# EAGLE design CoderDojo-ESP-board (EAGLE 9.6.2)

## Sheet 1 of 2
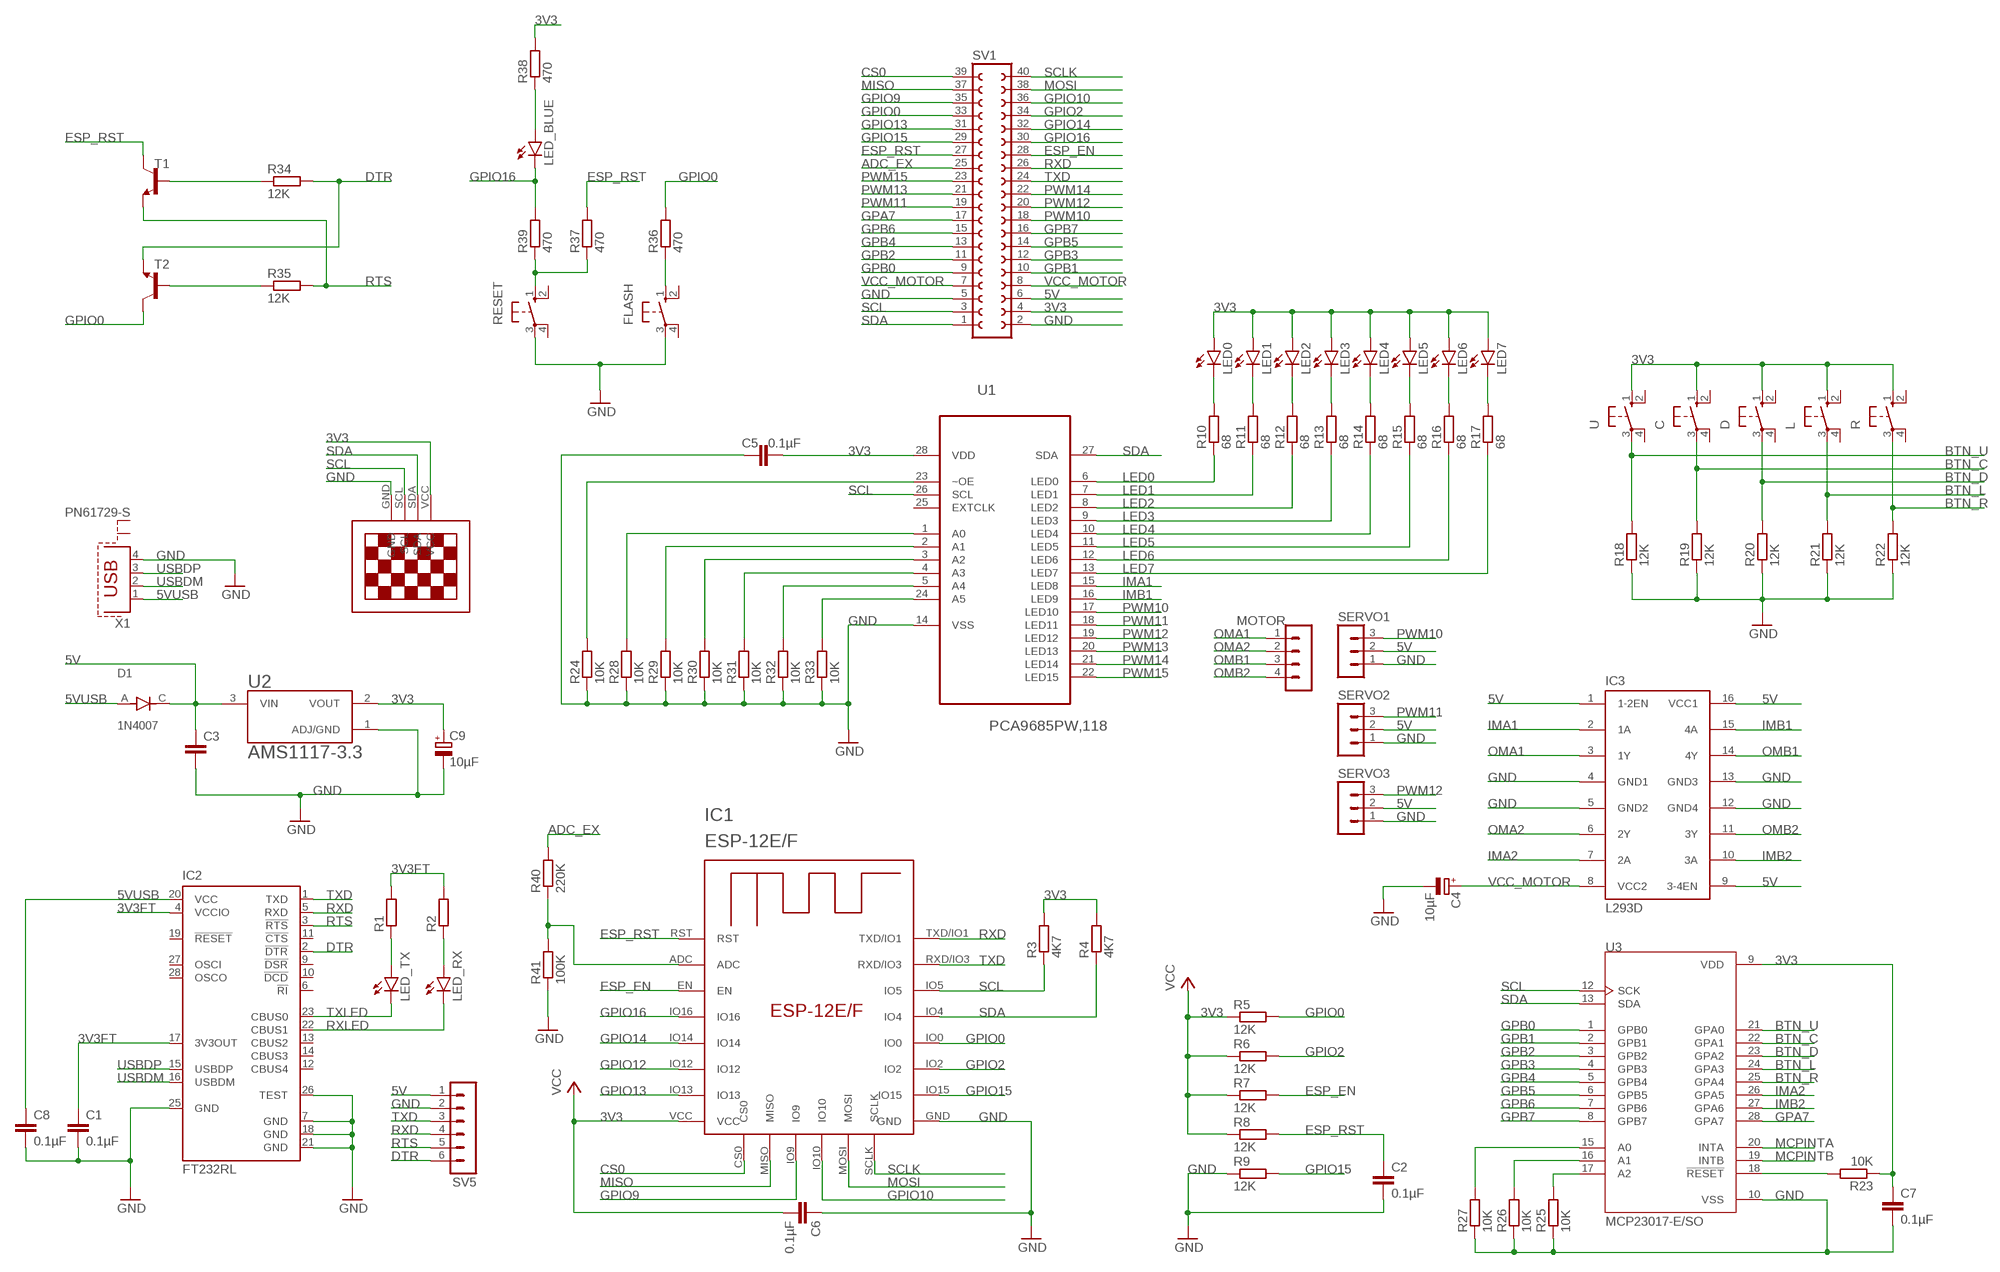
[diagram p0: schematic, sheet 1]

### Parts
C  10-XX  [B3F-10XX]
C1  0.1µF  C-EUC0805  [C0805]
C2  0.1µF  C-EUC0805  [C0805]
C3  C-EUC0805  [C0805]
C4  10µF  CPOL-EUE2-5  [E2-5]
C5  0.1µF  C-EUC0805  [C0805]
C6  0.1µF  C-EUC0805  [C0805]
C7  0.1µF  C-EUC0805  [C0805]
C8  0.1µF  C-EUC0805  [C0805]
C9  10µF  CPOL-EUE2-5  [E2-5]
D  10-XX  [B3F-10XX]
D1  1N4007  [DIOAD1060W80L520D270]
FLASH  10-XX  [B3F-10XX]
IC1  ESP-12E/F  [ESP-12E]
IC2  FT232RL  [SSOP28]
IC3  L293D  [DIL16]
L  10-XX  [B3F-10XX]
LED0  LED3MM  [LED3MM]
LED1  LED3MM  [LED3MM]
LED2  LED3MM  [LED3MM]
LED3  LED3MM  [LED3MM]
LED4  LED3MM  [LED3MM]
LED5  LED3MM  [LED3MM]
LED6  LED3MM  [LED3MM]
LED7  LED3MM  [LED3MM]
LED_BLUE  LEDSML0805  [SML0805]
LED_RX  LEDSML0805  [SML0805]
LED_TX  LEDSML0805  [SML0805]
MOTOR  MA04-1  [MA04-1]
R  10-XX  [B3F-10XX]
R1  R-EU_R0805  [R0805]
R2  R-EU_R0805  [R0805]
R3  4K7  R-EU_R0805  [R0805]
R4  4K7  R-EU_R0805  [R0805]
R5  12K  R-EU_R0805  [R0805]
R6  12K  R-EU_R0805  [R0805]
R7  12K  R-EU_R0805  [R0805]
R8  12K  R-EU_R0805  [R0805]
R9  12K  R-EU_R0805  [R0805]
R10  68  R-EU_R0805  [R0805]
R11  68  R-EU_R0805  [R0805]
R12  68  R-EU_R0805  [R0805]
R13  68  R-EU_R0805  [R0805]
R14  68  R-EU_R0805  [R0805]
R15  68  R-EU_R0805  [R0805]
R16  68  R-EU_R0805  [R0805]
R17  68  R-EU_R0805  [R0805]
R18  12K  R-EU_R0805  [R0805]
R19  12K  R-EU_R0805  [R0805]
R20  12K  R-EU_R0805  [R0805]
R21  12K  R-EU_R0805  [R0805]
R22  12K  R-EU_R0805  [R0805]
R23  10K  R-EU_R0805  [R0805]
R24  10K  R-EU_R0805  [R0805]
R25  10K  R-EU_R0805  [R0805]
R26  10K  R-EU_R0805  [R0805]
R27  10K  R-EU_R0805  [R0805]
R28  10K  R-EU_R0805  [R0805]
R29  10K  R-EU_R0805  [R0805]
R30  10K  R-EU_R0805  [R0805]
R31  10K  R-EU_R0805  [R0805]
R32  10K  R-EU_R0805  [R0805]
R33  10K  R-EU_R0805  [R0805]
R34  12K  R-EU_R0805  [R0805]
R35  12K  R-EU_R0805  [R0805]
R36  470  R-EU_R0805  [R0805]
R37  470  R-EU_R0805  [R0805]
R38  470  R-EU_R0805  [R0805]
R39  470  R-EU_R0805  [R0805]
R40  220K  R-EU_R0805  [R0805]
R41  100K  R-EU_R0805  [R0805]
RESET  10-XX  [B3F-10XX]
SERVO1  MA03-1  [MA03-1]
SERVO2  MA03-1  [MA03-1]
SERVO3  MA03-1  [MA03-1]
SV1  FE20-2  [FE20-2]
SV5  MA06-1  [MA06-1]
T1  BC817-40-NPN-SOT23-BEC  [SOT23-BEC]
T2  BC817-40-NPN-SOT23-BEC  [SOT23-BEC]
U  10-XX  [B3F-10XX]
U1  PCA9685PW,118  [SOP65P640X110-28N]
U2  AMS1117-3.3  [SOT229P700X180-4N]
U3  MCP23017-E/SO  [SOIC127P1030X265-28N]
U$1  13"OLED13"OLED  [1.3"OLED]
X1  PN61729-S  [PN61729-S]

### Nets
3V3: C5.2 C6.2 C7.1 C9.+ C.1(S) D.1(S) IC1.VCC L.1(S) LED0.A LED1.A LED2.A LED3.A LED4.A LED5.A LED6.A LED7.A R3.2 R4.2 R5.1 R6.1 R7.1 R8.1 R23.1 R38.2 R.1(S) SV1.4 U1.28(VDD) U2.2(VOUT) U3.9(VDD) U$1.VCC U.1(S) ; supply symbol labelled VCC
3V3FT: C1.1 IC2.4(VCCIO) IC2.17(3V3OUT) R1.2 R2.2
5V: C3.1 D1.C IC3.1(1-2EN) IC3.9(3-4EN) IC3.16(VCC1) SERVO1.2 SERVO2.2 SERVO3.2 SV1.6 SV5.1 U2.3(VIN)
5VUSB: C8.1 D1.A IC2.20(VCC) X1.1
ADC_EX: R40.2 SV1.25
BTN_C: C.3(P) R19.2 U3.22(GPA1)
BTN_D: D.3(P) R20.2 U3.23(GPA2)
BTN_L: L.3(P) R21.2 U3.24(GPA3)
BTN_R: R22.2 R.3(P) U3.25(GPA4)
BTN_U: R18.2 U3.21(GPA0) U.3(P)
CS0: IC1.CS0 SV1.39
DTR: IC2.2(!DTR) R34.2 SV5.6 T2.E
ESP_EN: IC1.EN R7.2 SV1.28
ESP_RST: C2.1 IC1.RST R8.2 R37.2 SV1.27 T1.C
GND: C1.2 C2.2 C3.2 C4.- C5.1 C6.1 C7.2 C8.2 C9.- FLASH.3(P) IC1.GND IC2.7(GND) IC2.18(GND) IC2.21(GND) IC2.25(GND) IC2.26(TEST) IC3.4(GND1) IC3.5(GND2) IC3.12(GND4) IC3.13(GND3) R9.1 R18.1 R19.1 R20.1 R21.1 R22.1 R24.1 R25.1 R26.1 R27.1 R28.1 R29.1 R30.1 R31.1 R32.1 R33.1 R41.1 RESET.3(P) SERVO1.1 SERVO2.1 SERVO3.1 SV1.2 SV1.5 SV5.2 U1.14(VSS) U2.1(ADJ/GND) U3.10(VSS) U$1.GND X1.4
GPA7: SV1.17 U3.28(GPA7)
GPB0: SV1.9 U3.1(GPB0)
GPB1: SV1.10 U3.2(GPB1)
GPB2: SV1.11 U3.3(GPB2)
GPB3: SV1.12 U3.4(GPB3)
GPB4: SV1.13 U3.5(GPB4)
GPB5: SV1.14 U3.6(GPB5)
GPB6: SV1.15 U3.7(GPB6)
GPB7: SV1.16 U3.8(GPB7)
GPIO0: IC1.IO0 R5.2 R36.2 SV1.33 T2.C
GPIO2: IC1.IO2 R6.2 SV1.34
GPIO9: IC1.IO9 SV1.35
GPIO10: IC1.IO10 SV1.36
GPIO12: IC1.IO12
GPIO13: IC1.IO13 SV1.31
GPIO14: IC1.IO14 SV1.32
GPIO15: IC1.IO15 R9.2 SV1.29
GPIO16: IC1.IO16 LED_BLUE.C R39.2 SV1.30
IMA1: IC3.2(1A) U1.15(LED8)
IMA2: IC3.7(2A) U3.26(GPA5)
IMB1: IC3.15(4A) U1.16(LED9)
IMB2: IC3.10(3A) U3.27(GPA6)
LED0: R10.1 U1.6(LED0)
LED1: R11.1 U1.7(LED1)
LED2: R12.1 U1.8(LED2)
LED3: R13.1 U1.9(LED3)
LED4: R14.1 U1.10(LED4)
LED5: R15.1 U1.11(LED5)
LED6: R16.1 U1.12(LED6)
LED7: R17.1 U1.13(LED7)
MCPINTA: U3.20(INTA)
MCPINTB: U3.19(INTB)
MISO: IC1.MISO SV1.37
MOSI: IC1.MOSI SV1.38
N$1: LED_TX.A R1.1
N$2: LED_RX.A R2.1
N$8: R24.2 U1.23(~OE)
N$10: R23.2 U3.18(!RESET)
N$15: R28.2 U1.1(A0)
N$16: R25.2 U3.17(A2)
N$17: IC1.ADC R40.1 R41.2
N$18: R26.2 U3.16(A1)
N$19: R27.2 U3.15(A0)
N$20: R29.2 U1.2(A1)
N$21: R30.2 U1.3(A2)
N$22: R31.2 U1.4(A3)
N$23: R32.2 U1.5(A4)
N$24: R33.2 U1.24(A5)
N$25: R34.1 T1.B
N$26: R35.1 T2.B
N$27: LED0.K(C) R10.2
N$28: LED1.K(C) R11.2
N$29: LED2.K(C) R12.2
N$30: LED3.K(C) R13.2
N$31: LED4.K(C) R14.2
N$32: LED5.K(C) R15.2
N$33: LED6.K(C) R16.2
N$34: LED7.K(C) R17.2
N$35: R37.1 R39.1 RESET.1(S)
N$36: FLASH.1(S) R36.1
N$37: LED_BLUE.A R38.1
OMA1: IC3.3(1Y) MOTOR.1
OMA2: IC3.6(2Y) MOTOR.2
OMB1: IC3.14(4Y) MOTOR.3
OMB2: IC3.11(3Y) MOTOR.4
PWM10: SERVO1.3 SV1.18 U1.17(LED10)
PWM11: SERVO2.3 SV1.19 U1.18(LED11)
PWM12: SERVO3.3 SV1.20 U1.19(LED12)
PWM13: SV1.21 U1.20(LED13)
PWM14: SV1.22 U1.21(LED14)
PWM15: SV1.23 U1.22(LED15)
RTS: IC2.3(!RTS) R35.2 SV5.5 T1.E
RXD: IC1.TXD/IO1 IC2.5(RXD) SV1.26 SV5.4
RXLED: IC2.22(CBUS1) LED_RX.C
SCL: IC1.IO5 R3.1 SV1.3 U1.26(SCL) U3.12(SCK) U$1.SCL
SCLK: IC1.SCLK SV1.40
SDA: IC1.IO4 R4.1 SV1.1 U1.27(SDA) U3.13(SDA) U$1.SDA
TXD: IC1.RXD/IO3 IC2.1(TXD) SV1.24 SV5.3
TXLED: IC2.23(CBUS0) LED_TX.C
USBDM: IC2.16(USBDM) X1.2
USBDP: IC2.15(USBDP) X1.3
VCC_MOTOR: C4.+ IC3.8(VCC2) SV1.7 SV1.8
Unconnected: C.2(S1) C.4(P1) D.2(S1) D.4(P1) FLASH.2(S1) FLASH.4(P1) IC2.6(!RI) IC2.9(!DSR) IC2.10(!DCD) IC2.11(!CTS) IC2.12(CBUS4) IC2.13(CBUS2) IC2.14(CBUS3) IC2.19(!RESET) IC2.27(OSCI) IC2.28(OSCO) L.2(S1) L.4(P1) R.2(S1) R.4(P1) RESET.2(S1) RESET.4(P1) U1.25(EXTCLK) U.2(S1) U.4(P1) X1.S1 X1.S2

## Sheet 2 of 2

## Library data of the parts
C D FLASH L R RESET U = switch-omron:10-XX: OMRON SWITCH; MPN: B3F-1000; OC_FARNELL: 176432; OC_NEWARK: 36M3542
C1-C3 C5-C8 = rcl:C-EU: CAPACITOR, European symbol; SPICEPREFIX: C
C4 C9 = rcl:CPOL-EU: POLARIZED CAPACITOR, European symbol; SPICEPREFIX: C
D1 = 1N4007:1N4007: Diode Switching 1KV 1A 2-Pin DO-41 Check prices <https://pricing.snapeda.com/parts/1N4007/ON%20Semiconductor/view-part?ref=eda>; AVAILABILITY: In Stock; DESCRIPTION: Diode Standard 1000V 1A Through Hole DO-204AL (DO-41); MF: ON Semiconductor; MP: 1N4007; PACKAGE: DO-41-2 ON Semiconductor; PRICE: None; PURCHASE-URL: https://pricing.snapeda.com/search/part/1N4007/?ref=eda
IC1 = esp-12e-f:ESP-12E/F
IC2 = ftdichip:FT232R: Source: http://www.ftdichip.com/Documents/DataSheets/DS_FT232R_v104.pdf; MPN: FT232RL; OC_FARNELL: 1146032; OC_NEWARK: 91K9918
IC3 = st-microelectronics:L293D: PUSH-PULL 4 CHANNEL DRIVER; MPN: L293D; OC_FARNELL: 9589619; OC_NEWARK: 56P8249
LED0 LED1-LED7 LED_BLUE LED_RX LED_TX = led:LED: LED OSRAM: - CHIPLED LG R971, LG N971, LY N971, LG Q971, LY Q971, LO R971, LY R971 LH N974, LH R974 LS Q976, LO Q976, LY Q976 LO Q996 - Hyper CHIPLED LW Q18S LB Q993, LB Q99A, LB R99A - SideLED LS A670, LO A670, LY A670, LG A670, LP A670 LB A673, LV A673, LT A673, LW A673 LH A674 LY A675 LS A676, LA A676, LO A676, LY A676, LW A676 LS A679, LY A679, LG A679 - Hyper Micro SIDELED® LS Y876, LA Y876, LO Y876, LY Y876 LT Y87S - SmartLED LW L88C, LW L88S LB L89C, LB L89S, LG L890 LS L89K, LO L89K, LY L89K LS L896, LA L896, LO L896, LY L896 - TOPLED LS T670, LO T670, LY T670, LG T670, LP T670 LSG T670, LSP T670, LSY T670, LOP T670, LYG T670 LG T671, LOG T671, LSG T671 LB T673, LV T673, LT T673, LW T673 LH T674 LS T676, LA T676, LO T676, LY T676, LB T676, LH T676, LSB T676, LW T676 LB T67C, LV T67C, LT T67C, LS T67K, LO T67K, LY T67K, LW E67C LS E67B, LA E67B, LO E67B, LY E67B, LB E67C, LV E67C, LT E67C LW T67C LS T679, LY T679, LG T679 LS T770, LO T770, LY T770, LG T770, LP T770 LB T773, LV T773, LT T773, LW T773 LH T774 LS E675, LA E675, LY E675, LS T675 LS T776, LA T776, LO T776, LY T776, LB T776 LHGB T686 LT T68C, LB T68C - Hyper Mini TOPLED® LB M676 - Mini TOPLED Santana® LG M470 LS M47K, LO M47K, LY M47K Source: http://www.osram.convergy.de LUXEON: - LUMILED® LXK2-PW12-R00, LXK2-PW12-S00, LXK2-PW14-U00, LXK2-PW14-V00 LXK2-PM12-R00, LXK2-PM12-S00, LXK2-PM14-U00 LXK2-PE12-Q00, LXK2-PE12-R00, LXK2-PE12-S00, LXK2-PE14-T00, LXK2-PE14-U00 LXK2-PB12-K00, LXK2-PB12-L00, LXK2-PB12-M00, LXK2-PB14-N00, LXK2-PB14-P00, LXK2-PB14-Q00 LXK2-PR12-L00, LXK2-PR12-M00, LXK2-PR14-Q00, LXK2-PR14-R00 LXK2-PD12-Q00, LXK2-PD12-R00, LXK2-PD12-S00 LXK2-PH12-R00, LXK2-PH12-S00 LXK2-PL12-P00, LXK2-PL12-Q00, LXK2-PL12-R00 Source: www.luxeon.com KINGBRIGHT: KA-3528ASYC Source: www.kingbright.com
MOTOR = con-lstb:MA04-1: PIN HEADER; OC_FARNELL: unknown; OC_NEWARK: unknown
R1-R41 = rcl:R-EU_: RESISTOR, European symbol; SPICEPREFIX: R
SERVO1-SERVO3 = con-lstb:MA03-1: PIN HEADER; OC_FARNELL: unknown; OC_NEWARK: unknown
SV1 = con-lsta:FE20-2: FEMALE HEADER; OC_FARNELL: unknown; OC_NEWARK: unknown
SV5 = con-lstb:MA06-1: PIN HEADER; OC_FARNELL: unknown; OC_NEWARK: unknown
T1 T2 = transistor:*-NPN-: NPN Transistror BF959 corrected 2008.03.06
U1 = PCA9685PW_118:PCA9685PW,118: 16-channel, 12-bit PWM Fm+ I2C-bus LED controller Check prices <https://pricing.snapeda.com/parts/PCA9685PW%2C118/NXP%20USA/view-part?ref=eda>; AVAILABILITY: In Stock; DESCRIPTION: LED Driver IC 16 Output Linear - PWM Dimming 25mA 28-TSSOP; MF: NXP USA; MP: PCA9685PW,118; PACKAGE: TSSOP-28 NXP Semiconductors; PRICE: None; PURCHASE-URL: https://pricing.snapeda.com/search/part/PCA9685PW,118/?ref=eda
U2 = AMS1117-3.3:AMS1117-3.3: Sot223/Pkg 1-Amp 3.3-Volt Low Drop Out Voltage Regulatator Check prices <https://pricing.snapeda.com/parts/AMS1117-3.3/Advanced%20Monolithic%20Systems/view-part?ref=eda>; AVAILABILITY: In Stock; DESCRIPTION: LDO Voltage Regulators 800MA LDO LINEAR REG; MF: Advanced Monolithic Systems; MP: AMS1117-3.3; PACKAGE: SOT-223 Seeed Technology; PRICE: None
U3 = MCP23017-E_SO:MCP23017-E/SO: MCP23017 Series 5.5 V 1.7 MHz SMT 16-Bit I2C I/O Expander - SOIC-28 Check prices <https://pricing.snapeda.com/parts/MCP23017-E/SO/Microchip%20Technology/view-part?ref=eda>; AVAILABILITY: In Stock; DESCRIPTION: I/O Expander 16 I²C 1.7 MHz 28-SOIC; MF: Microchip Technology; MP: MCP23017-E/SO; PACKAGE: None; PRICE: None; PURCHASE-URL: https://pricing.snapeda.com/search/part/MCP23017-E/SO/?ref=eda
U$1 = 13oled:13"OLED
X1 = con-berg:PN61729-S: BERG USB connector; OC_FARNELL: unknown; OC_NEWARK: unknown

## Board
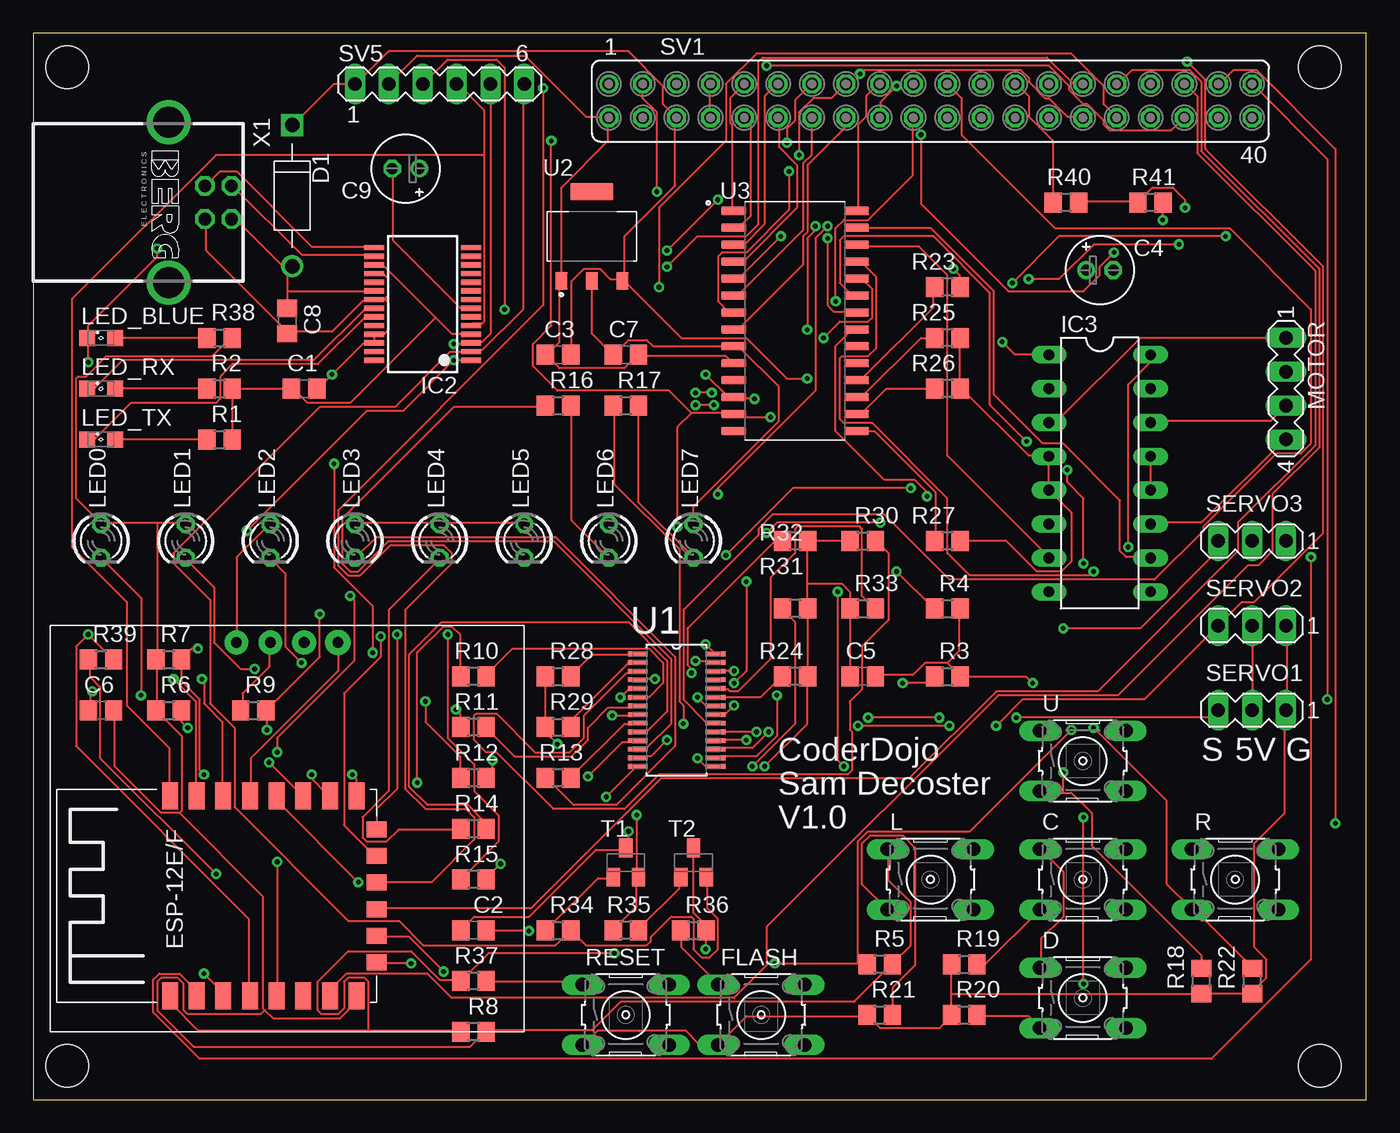
[diagram p1: board, top side]
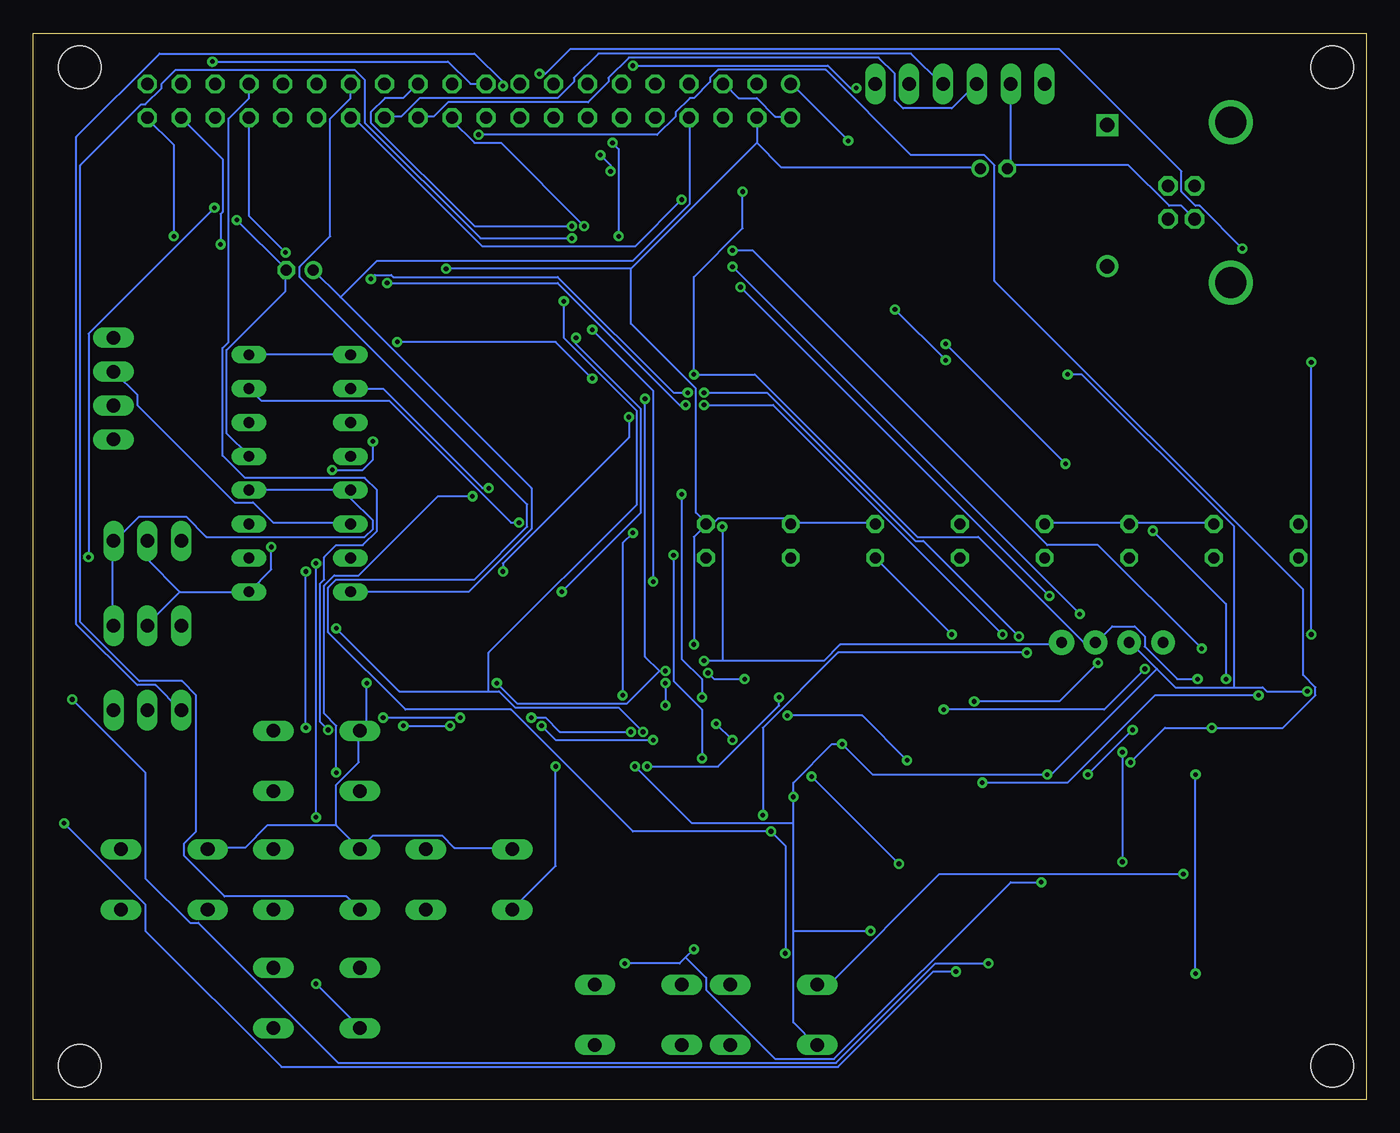
[diagram p2: board, bottom side, seen from below]

Size 100 x 80 mm. Coordinates in mm from the lower left corner, seen from the top.
Outline: 0,0 100,0 100,80 0,80 0,0
Copper layers (1*16): Top 0.035mm / dielectric 1.5mm / Bottom 0.035mm
Design rules "default": minimum track width 6mil, minimum drill 0.35mm, track to track 6mil, track to pad 6mil, pad to pad 6mil, via to via 6mil, smd to smd 6mil, copper to edge 40mil, drill to drill 6mil, minimum pad ring 10mil, minimum via ring 8mil, stop-mask expansion 4mil, vias tented up to drill 0mil, thermal gap 10mil
Holes 3.2 mm at 2.54,77.47 96.52,77.47 96.52,2.54 2.54,2.54

### Footprints (pad centres in the part's own frame; a part is rotated, then mirrored left to right if it is on the bottom)
B3F-10XX = drill 1.016 long: 1 -3.251,2.261; 2 3.251,2.261; 3 -3.251,-2.261; 4 3.251,-2.261
C0805 = smd 1.3 x 1.5: 1 -0.95,0; 2 0.95,0
E2-5 = drill 0.813 pad 1.27: + -1.016,0 | drill 0.813 pad 1.27 octagon: - 1.016,0
DIOAD1060W80L520D270 = drill 1.1 pad 1.65: A 5.3,0 | drill 1.1 pad 1.65 square: C -5.3,0
ESP-12E = smd 2 x 1.2: ADC -7.46,5.53; EN -7.46,3.53; GND 7.54,-6.47; IO0 7.54,-0.47; IO2 7.54,-2.47; IO4 7.54,1.53; IO5 7.54,3.53; IO12 -7.46,-2.47; IO13 -7.46,-4.47; IO14 -7.46,-0.47; IO15 7.54,-4.47; IO16 -7.46,1.53; RST -7.46,7.53; RXD/IO3 7.54,5.53; TXD/IO1 7.54,7.53; VCC -7.46,-6.47 | smd 1.2 x 1.5: CS0 -4.96,-7.97; IO9 -0.96,-7.97; IO10 1.04,-7.97; MISO -2.96,-7.97; MOSI 3.04,-7.97; SCLK 5.04,-7.97
SSOP28 = smd 0.4 x 1.5: 1 -4.225,-3.625; 2 -3.575,-3.625; 3 -2.925,-3.625; 4 -2.275,-3.625; 5 -1.625,-3.625; 6 -0.975,-3.625; 7 -0.325,-3.625; 8 0.325,-3.625; 9 0.975,-3.625; 10 1.625,-3.625; 11 2.275,-3.625; 12 2.925,-3.625; 13 3.575,-3.625; 14 4.225,-3.625; 15 4.225,3.625; 16 3.575,3.625; 17 2.925,3.625; 18 2.275,3.625; 19 1.625,3.625; 20 0.975,3.625; 21 0.325,3.625; 22 -0.325,3.625; 23 -0.975,3.625; 24 -1.625,3.625; 25 -2.275,3.625; 26 -2.925,3.625; 27 -3.575,3.625; 28 -4.225,3.625
DIL16 = drill 0.813 long: 1 -8.89,-3.81; 2 -6.35,-3.81; 3 -3.81,-3.81; 4 -1.27,-3.81; 5 1.27,-3.81; 6 3.81,-3.81; 7 6.35,-3.81; 8 8.89,-3.81; 9 8.89,3.81; 10 6.35,3.81; 11 3.81,3.81; 12 1.27,3.81; 13 -1.27,3.81; 14 -3.81,3.81; 15 -6.35,3.81; 16 -8.89,3.81
LED3MM = drill 0.813 octagon: A -1.27,0; K 1.27,0
SML0805 = smd 1.2 x 1.2: A 1.05,0; C -1.05,0
MA04-1 = drill 1.016 long: 1 -3.81,0; 2 -1.27,0; 3 1.27,0; 4 3.81,0
R0805 = smd 1.3 x 1.5: 1 -0.95,0; 2 0.95,0
MA03-1 = drill 1.016 long: 1 -2.54,0; 2 0,0; 3 2.54,0
FE20-2 = drill 0.914: 1 -24.13,1.27 | drill 0.914 octagon: 2 -24.13,-1.27; 3 -21.59,1.27; 4 -21.59,-1.27; 5 -19.05,1.27; 6 -19.05,-1.27; 7 -16.51,1.27; 8 -16.51,-1.27; 9 -13.97,1.27; 10 -13.97,-1.27; 11 -11.43,1.27; 12 -11.43,-1.27; 13 -8.89,1.27; 14 -8.89,-1.27; 15 -6.35,1.27; 16 -6.35,-1.27; 17 -3.81,1.27; 18 -3.81,-1.27; 19 -1.27,1.27; 20 -1.27,-1.27; 21 1.27,1.27; 22 1.27,-1.27; 23 3.81,1.27; 24 3.81,-1.27; 25 6.35,1.27; 26 6.35,-1.27; 27 8.89,1.27; 28 8.89,-1.27; 29 11.43,1.27; 30 11.43,-1.27; 31 13.97,1.27; 32 13.97,-1.27; 33 16.51,1.27; 34 16.51,-1.27; 35 19.05,1.27; 36 19.05,-1.27; 37 21.59,1.27; 38 21.59,-1.27; 39 24.13,1.27; 40 24.13,-1.27
MA06-1 = drill 1.016 long: 1 -6.35,0; 2 -3.81,0; 3 -1.27,0; 4 1.27,0; 5 3.81,0; 6 6.35,0
SOT23-BEC = smd 1 x 1.4: B -0.95,-1.1; C 0,1.1; E 0.95,-1.1
SOP65P640X110-28N = smd 1.473 x 0.356: 1 -2.921,4.216; 2 -2.921,3.581; 3 -2.921,2.921; 4 -2.921,2.286; 5 -2.921,1.626; 6 -2.921,0.965; 7 -2.921,0.33; 8 -2.921,-0.33; 9 -2.921,-0.965; 10 -2.921,-1.626; 11 -2.921,-2.286; 12 -2.921,-2.921; 13 -2.921,-3.581; 14 -2.921,-4.216; 15 2.921,-4.216; 16 2.921,-3.581; 17 2.921,-2.921; 18 2.921,-2.286; 19 2.921,-1.626; 20 2.921,-0.965; 21 2.921,-0.33; 22 2.921,0.33; 23 2.921,0.965; 24 2.921,1.626; 25 2.921,2.286; 26 2.921,2.921; 27 2.921,3.581; 28 2.921,4.216
SOT229P700X180-4N = smd 0.93 x 1.31: 1 -2.29,-3.345; 2 0,-3.345; 3 2.29,-3.345 | smd 3.24 x 1.31: 4 0,3.345
SOIC127P1030X265-28N = smd 1.9 x 0.6: 1 -4.605,8.255; 2 -4.605,6.985; 3 -4.605,5.715; 4 -4.605,4.445; 5 -4.605,3.175; 6 -4.605,1.905; 7 -4.605,0.635; 8 -4.605,-0.635; 9 -4.605,-1.905; 10 -4.605,-3.175; 11 -4.605,-4.445; 12 -4.605,-5.715; 13 -4.605,-6.985; 14 -4.605,-8.255; 15 4.605,-8.255; 16 4.605,-6.985; 17 4.605,-5.715; 18 4.605,-4.445; 19 4.605,-3.175; 20 4.605,-1.905; 21 4.605,-0.635; 22 4.605,0.635; 23 4.605,1.905; 24 4.605,3.175; 25 4.605,4.445; 26 4.605,5.715; 27 4.605,6.985; 28 4.605,8.255
1.3"OLED = drill 0.8 pad 1.778: GND 2.54,0; SCL 5.08,0; VCC 0,0 | drill 0.8 pad 1.9: SDA 7.62,0
PN61729-S = drill 0.95 octagon: 1 1.25,4.71; 2 -1.25,4.71; 3 -1.25,2.71; 4 1.25,2.71 | drill 2.3 pad 2.9: S1 -6.02,0; S2 6.02,0

### Placement (x,y rotation side)
C  78.74,16.51 0 top
C1  20.32,53.34 0 top
C2  33.02,12.7 0 top
C3  39.37,55.88 180 top
C4  80.01,62.23 0 top
C5  62.23,31.75 0 top
C6  5.08,29.21 0 top
C7  44.45,55.88 0 top
C8  19.05,58.42 270 top
C9  27.94,69.85 180 top
D  78.74,7.62 0 top
D1  19.43,67.82 270 top
FLASH  54.61,6.35 0 top
IC1  17.78,15.24 90 top
IC2  29.21,59.69 90 top
IC3  80.01,46.99 270 top
L  67.31,16.51 0 top
LED0  5.08,41.91 270 top
LED1  11.43,41.91 270 top
LED2  17.78,41.91 270 top
LED3  24.13,41.91 270 top
LED4  30.48,41.91 270 top
LED5  36.83,41.91 270 top
LED6  43.18,41.91 270 top
LED7  49.53,41.91 270 top
LED_BLUE  5.08,57.15 0 top
LED_RX  5.08,53.34 0 top
LED_TX  5.08,49.53 0 top
MOTOR  93.98,53.34 270 top
R  90.17,16.51 0 top
R1  13.97,49.53 0 top
R2  13.97,53.34 0 top
R3  68.58,31.75 0 top
R4  68.58,36.83 0 top
R5  63.5,10.16 180 top
R6  10.16,29.21 0 top
R7  10.16,33.02 0 top
R8  33.02,5.08 180 top
R9  16.51,29.21 0 top
R10  33.02,31.75 180 top
R11  33.02,27.94 180 top
R12  33.02,24.13 180 top
R13  39.37,24.13 180 top
R14  33.02,20.32 180 top
R15  33.02,16.51 180 top
R16  39.37,52.07 0 top
R17  44.45,52.07 0 top
R18  87.63,8.89 90 top
R19  69.85,10.16 0 top
R20  69.85,6.35 0 top
R21  63.5,6.35 0 top
R22  91.44,8.89 90 top
R23  68.58,60.96 180 top
R24  57.15,31.75 180 top
R25  68.58,57.15 180 top
R26  68.58,53.34 180 top
R27  68.58,41.91 180 top
R28  39.37,31.75 0 top
R29  39.37,27.94 0 top
R30  62.23,41.91 0 top
R31  57.15,41.91 180 top
R32  57.15,36.83 180 top
R33  62.23,36.83 0 top
R34  39.37,12.7 0 top
R35  44.45,12.7 180 top
R36  49.53,12.7 0 top
R37  33.02,8.89 180 top
R38  13.97,57.15 0 top
R39  5.08,33.02 0 top
R40  77.47,67.31 180 top
R41  83.82,67.31 180 top
RESET  44.45,6.35 0 top
SERVO1  91.44,29.21 180 top
SERVO2  91.44,35.56 180 top
SERVO3  91.44,41.91 180 top
SV1  67.31,74.93 0 top
SV5  30.48,76.2 0 top
T1  44.45,17.78 0 top
T2  49.53,17.78 0 top
U  78.74,25.4 0 top
U1  48.26,29.21 0 top
U2  41.91,64.77 0 top
U3  57.15,58.42 0 top
U$1  15.24,34.29 0 top
X1  10.16,67.31 270 top

### Tracks (layer width: path | path; a pad name or v marks a point on that pad's centre or on a via)
3V3  (via drill 0.35)
  Top 0.152: L.1 64.16,18.75 64.16,16.46 65.84,14.78 65.84,11.58 64.47,10.21 R5.1 64.31,10.06 61.57,7.32 44.04,7.32 41.91,5.18 33.98,5.18 R8.1 33.83,5.03 32.77,3.96 12.04,3.96 9.3,6.71 9.3,8.84 9.6,9.14 10.82,9.14 11.28,8.69 11.28,6.71 11.58,6.4 17.07,6.4 17.37,6.71 | 68.58,32.77 66.9,32.77 65.99,31.85 63.25,31.85 C5.2 | 68.58,32.77 69.49,31.85 R3.2 69.65,31.7 74.52,31.7 v74.98,31.24 | 68.58,32.77 69.49,33.68 69.49,36.73 R4.2 | D.1 75.59,9.91 75.59,12.04 77.27,13.72 77.27,17.07 75.59,18.75 C.1 | v69.04,62.33 69.49,61.87 69.49,60.96 R23.1 | 10.97,21.49 9.6,21.49 6.1,24.99 6.1,29.11 C6.2 | 10.97,21.49 11.12,21.64 11.12,27.28 9.3,29.11 R6.1 9.3,29.26 9.3,32.92 R7.1 9.3,33.07 9.3,43.28 | 17.37,6.71 17.22,6.86 17.22,15.24 10.97,21.49 | 17.37,6.71 17.98,6.1 23.01,6.1 24.23,7.32 24.23,7.77 IC1.VCC | R38.2 14.78,57.15 13.41,55.78 5.49,55.78 3.96,54.25 3.35,54.25 3.2,54.1 3.2,45.11 5.03,43.28 LED0.A 5.18,43.28 9.3,43.28 | 9.3,43.28 11.43,43.28 LED1.A | U2.2 41.91,57.45 43.43,55.93 C7.1 43.59,55.93 44.65,57 46.02,57 46.48,56.54 52.43,56.54 U3.9 52.58,56.39 53.03,56.39 55.93,53.49 55.93,50.9 49.53,44.5 LED7.A | v50.44,34.14 51.05,33.53 U1.28 | 30.48,43.28 24.23,43.28 LED3.A | U$1.VCC 15.24,40.69 17.68,43.13 LED2.A | 30.48,43.28 36.73,43.28 LED5.A | 30.48,43.28 LED4.A
  Bottom 0.152: 77.27,20.57 77.27,23.62 75.59,25.3 75.59,27.58 U.1 75.44,27.74 74.98,28.19 v74.98,31.24 | 77.27,20.57 75.59,18.9 C.1 75.44,18.9 74.52,19.81 69.34,19.81 68.43,18.9 64.16,18.9 L.1 | 77.27,20.57 82.45,20.57 84.12,18.9 86.87,18.9 R.1 | 55.17,62.33 v69.04,62.33 | 45.72,71.78 55.17,62.33 | SV1.4 45.72,71.78 | 45.72,71.78 43.89,69.95 28.96,69.95 C9.+ | v50.44,34.14 50.44,42.22 49.53,43.13 LED7.A 49.53,43.28 | LED5.A 36.88,43.28 43.13,43.28 LED6.A 43.59,43.59 48.62,43.59 48.92,43.28 49.53,43.28 | LED3.A 24.08,43.28 17.83,43.28 LED2.A 17.68,43.28 11.43,43.28 LED1.A | 55.17,62.33 55.17,58.22 50.29,53.34 50.29,44.04 49.53,43.28
3V3FT
  Top 0.152: 14.94,53.34 14.94,49.53 R1.2 | 14.94,53.34 C1.1 19.51,53.34 20.57,52.27 23.77,52.27 30.18,58.67 | 14.94,53.34 R2.2 | 30.18,58.67 26.36,62.48 25.6,62.48 IC2.17 | 30.18,58.67 31.39,57.45 32.77,57.45 IC2.4
5V  (via drill 0.35)
  Top 0.152: SERVO2.2 SERVO1.2 | IC3.16 83.82,55.32 82.14,53.65 v82.14,41.45 | D1.C 19.51,73.15 22.55,76.2 SV5.1 24.23,76.2 26.67,78.64 44.65,78.64 47.24,76.05 47.24,74.68 SV1.6 48.16,73.61 48.16,68.58 44.35,64.77 44.35,61.57 U2.3 | U2.3 44.2,61.57 43.28,61.57 42.52,62.33 41.3,62.33 40.39,61.42 40.39,55.93 C3.1 | v72.69,56.84 73.61,55.93 76.2,55.93 IC3.1 | v58.06,54.1 56.54,54.1 53.49,57.15 48.62,57.15 44.35,61.42 U2.3
  Bottom 0.152: IC3.1 76.2,55.93 83.82,55.93 IC3.16 | 89,38.1 IC3.9 82.14,39.78 v82.14,41.45 | 89,38.1 91.44,35.66 SERVO2.2 | SERVO3.2 91.44,40.54 89,38.1 | v72.69,56.84 60.81,56.84 v58.06,54.1
5VUSB
  Top 0.152: 19.05,62.18 19.05,60.66 | 19.05,60.66 C8.1 | 19.05,62.18 19.36,62.48 D1.A 19.05,62.18 | 19.05,60.66 25.45,60.66 IC2.20 | 19.05,62.18 15.24,65.99 14.94,65.99 X1.1
ADC_EX
  Top 0.152: R40.2 76.5,67.36 76.5,71.93 74.68,73.76 74.68,75.29 73.76,76.2 SV1.25
BTN_C  (via drill 0.35)
  Top 0.152: R19.2 70.87,10.21 71.48,10.21 75.44,14.17 C.3 | v59.59,64.62 59.59,59.59 60.05,59.13 61.72,59.13 U3.22
  Bottom 0.152: v59.59,64.62 66.45,64.62 75.13,73.3 75.13,76.5 75.89,77.27 89.31,77.27 90.37,76.2 90.37,75.89 91.59,74.68 91.9,74.68 96.47,70.1 96.47,35.81 92.05,31.39 88.85,31.39 87.78,30.33 87.78,20.12 88.7,19.2 88.7,18.29 85.65,15.24 76.5,15.24 75.59,14.33 C.3
BTN_D  (via drill 0.35)
  Top 0.152: R20.2 70.87,6.25 74.68,6.25 75.44,5.49 D.3 | v74.52,49.38 71.78,52.12 71.78,60.5 67.51,64.77 60.81,64.77 60.5,64.47 60.5,61.27 61.42,60.35 61.72,60.35 U3.23 | v77.57,47.24 77.57,46.33 78.79,45.11 v78.79,40.23 | v78.79,8.69 v78.79,21.18
  Bottom 0.152: v74.52,49.38 74.52,48.01 75.29,47.24 v77.57,47.24 | v78.79,21.18 v78.79,40.23 | v78.79,8.69 75.59,5.49 D.3
BTN_L  (via drill 0.35)
  Top 0.152: R21.2 64.47,6.4 64.47,8.38 66.14,10.06 66.14,18.9 65.23,19.81 62.79,19.81 62.18,19.2 62.18,16.15 64.01,14.33 L.3 | v59.28,57.15 60.5,58.37 62.64,58.37 62.94,58.67 62.94,60.81 62.18,61.57 61.87,61.57 U3.24 | v60.35,38.1 60.35,25.45 v60.81,24.99
  Bottom 0.152: v59.28,57.15 59.28,56.69 54.41,51.82 54.41,44.04 v60.35,38.1 | v60.81,24.99 60.81,17.53 64.01,14.33 L.3
BTN_R  (via drill 0.35)
  Top 0.152: R22.2 91.44,9.91 87.02,14.33 R.3 86.87,14.33 85.04,16.15 85.04,22.4 v79.55,27.89 | v79.55,39.62 79.25,39.32 70.26,39.32 68.58,41 68.58,45.11 62.94,50.75 60.81,50.75 60.5,51.05 60.5,55.63 60.66,55.78 62.64,55.78 63.25,56.39 63.25,61.72 62.18,62.79 61.87,62.79 U3.25
  Bottom 0.152: v79.55,27.89 v79.55,39.62
BTN_U  (via drill 0.35)
  Top 0.152: R18.2 87.63,10.82 79.4,19.05 79.4,21.49 77.88,23.01 77.27,23.01 | 77.27,23.01 75.59,23.01 U.3 | v67.06,45.26 67.06,45.57 66.14,46.48 63.86,46.48 60.2,50.14 60.2,56.54 61.42,57.76 61.72,57.76 U3.21 | 77.27,23.01 v77.27,24.54
  Bottom 0.152: v67.06,45.26 69.65,45.26 75.59,39.32 77.42,39.32 78.18,38.56 78.18,28.96 77.27,28.04 v77.27,24.54
CS0  (via drill 0.35)
  Top 0.152: v28.35,10.21 25.76,10.21 IC1.CS0 | v97.08,30.02 97.08,70.56 SV1.39
  Bottom 0.152: v28.35,10.21 32.31,10.21 39.78,2.74 77.11,2.74 87.63,13.26 88.24,13.26 91.59,16.61 91.59,24.54 v97.08,30.02
DTR
  Top 0.152: T2.E 50.6,16.61 50.6,14.33 51.36,13.56 51.36,11.28 50.75,10.67 50.14,10.67 49.53,11.28 49.53,13.56 49.38,13.72 47.85,13.72 46.33,12.19 46.33,11.89 46.02,11.58 41.45,11.58 40.39,12.65 R34.2 40.23,12.65 39.17,11.58 29.26,11.58 27.43,13.41 23.62,13.41 15.09,21.95 15.09,27.89 13.26,29.72 13.26,37.49 10.52,40.23 10.52,41 21.49,51.97 27.13,51.97 31.24,56.08 32.77,56.08 IC2.2 32.92,56.24 33.68,56.24 36.73,59.28 36.73,76.2 SV5.6
ESP_EN  (via drill 0.35)
  Top 0.152: v12.8,24.38 12.5,24.69 12.5,30.02 11.12,31.39 11.12,32.92 R7.2 11.12,33.07 11.89,33.83 v12.34,33.83 | v12.8,9.45 14.33,7.92 IC1.EN | v47.55,63.7 v51.36,67.51
  Bottom 0.152: v12.8,9.45 v12.8,24.38 | v51.36,67.51 54.86,64.01 66.29,64.01 75.89,73.61 76.2,73.61 SV1.28 | v47.55,63.7 46.02,63.7 23.93,41.6 20.12,41.6 v12.34,33.83
ESP_RST  (via drill 0.35)
  Top 0.152: 25.15,5.18 12.34,5.18 10.36,7.16 10.36,7.77 IC1.RST | 25.15,5.18 32,5.18 R8.2 | 25.15,5.18 25.15,8.84 24.84,9.14 23.62,9.14 23.32,8.84 23.32,6.86 22.86,6.4 21.64,6.4 21.34,6.71 21.34,8.84 23.62,11.12 28.35,11.12 30.48,8.99 32,8.99 R37.2 32.16,8.99 34.14,10.97 v43.59,10.97 | C2.1 32.16,12.8 33.07,13.72 37.19,13.72 42.22,18.75 44.35,18.75 T1.C 44.5,18.9 44.65,19.05 v44.65,20.12
  Bottom 0.152: SV1.27 76.2,75.13 77.72,73.61 77.72,64.77 80.01,62.48 80.01,61.72 62.94,44.65 62.94,42.98 66.9,39.01 77.27,39.01 77.88,38.41 77.88,35.05 72.08,29.26 64.16,29.26 55.02,20.12 v44.65,20.12 43.59,19.05 v43.59,10.97
GND  (via drill 0.35)
  Top 0.152: v84.73,65.99 84.73,67.21 R41.1 | IC3.13 IC3.12 | R25.1 69.49,57.15 69.49,53.34 R26.1 69.65,53.34 74.68,48.31 76.2,48.31 IC3.4 IC3.5 77.88,44.04 77.88,40.39 77.11,39.62 75.29,39.62 73,41.91 R27.1 | SERVO2.1 94.03,35.51 94.03,29.26 SERVO1.1 93.88,29.11 93.88,21.49 91.59,19.2 91.59,11.43 92.51,10.52 92.51,9.14 91.44,8.08 R22.1 91.44,7.92 87.63,7.92 | 68.89,7.92 68.89,6.4 R20.1 68.89,6.25 67.97,5.33 63.55,5.33 62.64,6.25 R21.1 62.48,6.25 53.49,6.25 51.36,4.12 | 68.89,7.92 68.89,10.06 R19.1 | 68.89,7.92 87.63,7.92 | 87.63,7.92 R18.1 | U3.10 52.43,55.32 51.97,55.78 45.41,55.78 C7.2 45.26,55.78 44.35,54.86 39.47,54.86 38.56,55.78 C3.2 38.56,55.93 39.47,56.84 39.47,61.42 U2.1 39.62,61.57 39.62,68.43 43.13,71.93 43.13,73.61 SV1.2 43.13,73.76 41.45,73.76 36.88,78.33 28.8,78.33 SV5.2 | IC2.7 32.77,59.44 32,59.44 26.98,64.47 26.98,69.8 C9.- | C1.2 21.34,53.34 v22.4,54.41 24.69,56.69 25.45,56.69 IC2.26 25.6,56.84 25.6,57.3 IC2.25 25.6,57.45 26.36,57.45 26.67,57.76 26.67,59.74 26.36,60.05 | 19.05,57.61 22.4,57.61 24.69,59.89 25.45,59.89 IC2.21 25.6,60.05 26.36,60.05 | 26.36,60.05 26.67,60.35 26.67,61.57 26.36,61.87 25.6,61.87 IC2.18 | 19.05,57.61 12.95,63.7 12.95,65.99 X1.4 | 19.05,57.61 C8.2 | v4.42,30.63 4.27,30.48 4.27,29.26 C6.1 | R9.1 15.7,29.26 15.7,30.48 17.68,32.46 17.68,34.29 U$1.GND | v23.93,24.38 24.23,24.08 24.23,22.86 IC1.GND | C5.1 61.27,31.85 61.27,36.73 R33.1 61.27,36.88 61.27,38.1 60.66,38.71 58.06,38.71 | R30.1 R31.1 58.06,41.91 58.06,38.71 | 58.06,38.71 58.06,36.88 R32.1 58.06,36.73 58.06,31.85 R24.1 58.06,31.7 58.06,28.19 v54.86,24.99
  Top 0.152: R28.1 38.41,31.7 38.41,28.04 R29.1 38.56,27.89 38.56,27.43 v39.32,26.67 | v42.98,22.71 45.26,24.99 U1.14 | v37.19,12.65 33.98,12.65 C2.2 | 51.36,4.12 49.99,4.12 48.92,5.18 42.37,5.18 41.3,4.12 RESET.3 | 51.36,4.12 FLASH.3
  Bottom 0.152: v84.73,65.99 81.08,62.33 C4.- 81.08,62.18 81.08,60.66 85.5,56.24 85.5,49.99 83.82,48.31 IC3.13 | IC3.12 IC3.5 76.2,45.11 74.52,43.43 74.52,42.82 75.13,42.22 87.02,42.22 88.54,43.74 92.05,43.74 93.88,41.91 SERVO3.1 94.03,41.91 94.03,35.66 SERVO2.1 | SV1.2 43.28,73.76 44.35,73.76 45.72,75.13 47.09,75.13 48.16,76.2 SV1.5 | 26.67,70.1 SV5.2 | 26.67,70.1 C9.- 26.82,69.95 | 26.67,70.1 17.83,70.1 14.78,67.06 13.87,67.06 12.95,66.14 X1.4 | v4.42,30.63 7.47,30.63 7.77,30.94 9.91,30.94 | 9.91,30.94 14.33,30.94 15.7,32.31 | 15.7,32.31 17.68,34.29 U$1.GND | 15.7,32.31 23.62,24.38 v23.93,24.38 37.03,24.38 v39.32,26.67 40.08,26.67 42.98,23.77 v42.98,22.71 42.98,20.73 | 42.98,12.65 42.98,5.79 41.3,4.12 RESET.3 | 42.98,12.65 42.98,20.73 | 42.98,12.65 v37.19,12.65 | v54.86,24.99 50.6,20.73 42.98,20.73 | v22.4,54.41 21.34,54.41 9.91,42.98 9.91,30.94
GPA7
  Top 0.152: U3.28 61.87,66.75 61.87,73.15 62.48,73.76 62.48,75.29 63.4,76.2 SV1.17
GPB0
  Top 0.152: SV1.9 52.27,75.13 52.27,73.3 52.43,73.15 52.43,66.75 U3.1
GPB1
  Top 0.152: U3.2 52.58,65.53 53.03,65.53 53.8,66.29 53.8,73.15 53.34,73.61 SV1.10
GPB2
  Top 0.152: U3.3 52.58,64.16 53.34,64.16 54.86,65.68 54.86,75.29 55.78,76.2 SV1.11
GPB3
  Top 0.152: U3.4 52.58,62.94 53.34,62.94 57.3,66.9 57.3,70.1 55.93,71.48 55.93,73.61 SV1.12
GPB4  (via drill 0.35)
  Top 0.152: v56.08,64.77 53.03,61.72 52.58,61.72 U3.5 | v56.54,71.78 56.54,72.85 57.15,73.46 57.15,74.98 58.37,76.2 SV1.13
  Bottom 0.152: v56.08,64.77 56.08,71.32 v56.54,71.78
GPB5
  Top 0.152: U3.6 52.58,60.35 52.88,60.35 57.76,65.23 57.76,70.26 58.37,70.87 58.37,73.61 SV1.14
GPB6  (via drill 0.35)
  Top 0.152: v56.69,69.65 56.69,66.75 53.49,63.55 51.66,63.55 51.36,63.25 51.36,59.89 52.12,59.13 52.43,59.13 U3.7 | v57.45,70.87 57.45,74.07 58.52,75.13 59.89,75.13 SV1.15
  Bottom 0.152: v56.69,69.65 56.69,70.1 v57.45,70.87
GPB7
  Top 0.152: SV1.16 60.96,73 58.06,70.1 58.06,65.08 57.76,64.77 57.76,62.64 53.03,57.91 52.58,57.91 U3.8
GPIO0  (via drill 0.35)
  Top 0.152: T2.C 49.53,14.02 50.44,13.11 50.44,12.8 R36.2 50.44,12.65 v50.44,11.28 | v55.63,10.21 61.87,10.21 | 61.87,10.21 62.48,10.21 R5.2 | v24.38,16.31 18.29,22.4 18.29,22.71 IC1.IO0 | v77.88,27.74 70.26,20.12 62.64,20.12 61.87,19.36 61.87,10.21
  Bottom 0.152: v55.63,10.21 51.51,10.21 51.05,10.67 | v50.44,11.28 51.05,10.67 | v24.38,16.31 26.67,16.31 39.93,3.05 44.35,3.05 49.53,8.23 49.53,9.14 51.05,10.67 | SV1.33 83.82,75.13 85.34,73.61 85.34,56.84 85.8,56.39 85.8,48.31 84.12,46.63 75.13,46.63 74.22,45.72 74.22,42.67 75.29,41.6 77.27,41.6 78.18,40.69 78.18,39.01 78.49,38.71 78.49,28.35 v77.88,27.74
GPIO2  (via drill 0.35)
  Top 0.152: v11.58,27.89 11.12,28.35 11.12,29.11 R6.2 | v17.68,25.3 20.12,22.86 IC1.IO2 | v81.08,63.55 80.01,62.48 80.01,61.87 78.79,60.66 73.15,60.66 66.6,67.21 v66.6,72.39
  Bottom 0.152: v17.68,25.3 15.09,27.89 v11.58,27.89 6.25,27.89 3.81,30.33 3.81,30.94 4.72,31.85 4.72,38.25 27.89,61.42 27.89,70.1 28.65,70.87 34.14,70.87 40.54,77.27 48.62,77.27 49.23,76.66 49.23,76.35 50.44,75.13 50.75,75.13 51.82,74.07 51.82,73.76 53.19,72.39 v66.6,72.39 | SV1.34 83.82,66.29 v81.08,63.55
GPIO9
  Top 0.152: IC1.IO9 25.76,14.33 37.34,14.33 47.09,24.08 65.68,24.08 72.24,30.63 79.86,30.63 90.37,41.15 90.37,43.28 96.16,49.07 96.16,62.18 87.33,71.02 87.33,75.29 86.41,76.2 SV1.35
GPIO10  (via drill 0.35)
  Top 0.152: v38.25,75.89 38.25,59.59 22.86,44.2 22.86,40.08 23.62,39.32 24.54,39.32 26.82,41.6 30.79,41.6 31.39,41 31.39,40.23 27.89,36.73 27.89,23.32 29.41,21.79 32.46,21.79 33.07,21.18 33.07,19.51 29.87,16.31 25.76,16.31 IC1.IO10 | v55.02,77.57 76.2,77.57 77.72,76.05 77.72,75.74 78.79,74.68 79.1,74.68 80.31,73.46 80.31,73.15 80.77,72.69 85.34,72.69 86.26,73.61 SV1.36
  Bottom 0.152: v38.25,75.89 38.71,75.89 40.39,77.57 v55.02,77.57
GPIO13
  Top 0.152: IC1.IO13 22.25,7.92 22.25,8.23 23.47,9.45 29.57,9.45 31.39,7.62 52.58,7.62 55.02,10.06 55.02,12.95 72.39,30.33 81.38,30.33 91.14,40.08 91.9,40.08 92.96,41.15 92.96,45.41 96.47,48.92 96.47,62.33 87.63,71.17 87.63,76.35 86.72,77.27 82.45,77.27 81.38,76.2 SV1.31
GPIO14  (via drill 0.35)
  Top 0.152: v18.29,17.83 18.29,7.92 IC1.IO14 | v18.29,26.06 18.29,27.13 24.08,32.92 24.08,37.49 v23.77,37.8 | v46.94,60.96 46.94,66.9 51.97,71.93 51.97,76.2 54.25,78.49 77.88,78.49 80.31,76.05 80.31,74.68 81.23,73.76 SV1.32
  Bottom 0.152: v18.29,26.06 v18.29,17.83 | v46.94,60.96 v23.77,37.8
GPIO15  (via drill 0.35)
  Top 0.152: v17.53,27.74 17.53,29.11 R9.2 17.53,29.26 21.49,33.22 v21.49,36.42 | v20.88,24.38 20.88,24.08 22.1,22.86 IC1.IO15 | SV1.29 78.03,76.2 76.05,78.18 54.71,78.18 54.41,77.88 54.41,65.68 53.49,64.77 49.84,64.77 v47.55,62.48
  Bottom 0.152: v20.88,24.38 v17.53,27.74 | v21.49,36.42 v47.55,62.48
GPIO16  (via drill 0.35)
  Top 0.152: v4.12,55.32 4.12,57.15 | R39.2 5.94,33.07 v4.12,34.9 3.2,33.98 3.2,26.52 16.15,13.56 16.15,7.92 IC1.IO16 | v62.03,76.96 62.33,77.27 74.07,77.27 74.68,76.66 74.68,76.35 75.89,75.13 76.2,75.13 77.57,73.76 78.64,73.76 SV1.30 | v9.3,63.86 9.3,63.25 4.12,58.06 4.12,57.15 | 4.12,57.15 LED_BLUE.C
  Bottom 0.152: v4.12,34.9 v4.12,55.32 | v62.03,76.96 61.57,76.96 59.74,78.79 23.01,78.79 13.87,69.65 13.87,68.12 12.8,67.06 12.5,67.06 v9.3,63.86
IMA1  (via drill 0.35)
  Top 0.152: U1.15 50.44,24.99 v49.84,25.6 | v51.97,40.84 57,45.87 v65.84,45.87
  Bottom 0.152: v49.84,25.6 49.84,29.26 51.97,31.39 v51.97,40.84 | v65.84,45.87 66.29,45.87 73.76,53.34 IC3.2
IMA2
  Top 0.152: U3.26 61.87,64.01 66.45,64.01 68.58,61.87 68.58,48.31 76.2,40.69 IC3.7
IMB1  (via drill 0.35)
  Top 0.152: v55.78,30.33 55.78,27.28 54.25,25.76 51.21,25.76 U1.16 | v55.02,42.52 55.78,43.28 v63.55,43.28
  Bottom 0.152: v55.78,30.33 55.78,41.76 v55.02,42.52 | v63.55,43.28 64.16,43.28 73.3,52.43 82.91,52.43 IC3.15
IMB2
  Top 0.152: U3.27 61.87,65.38 67.36,65.38 72.08,60.66 72.08,52.88 75.74,49.23 77.27,49.23 81.53,44.96 81.53,41.15 81.99,40.69 83.82,40.69 IC3.10
LED0
  Top 0.152: U1.6 46.18,30.18 47.24,31.24 47.24,32.77 46.18,33.83 35.97,33.83 33.98,31.85 R10.1
LED1
  Top 0.152: U1.7 45.26,29.41 43.13,29.41 41.6,27.89 41.6,26.98 40.39,25.76 36.12,25.76 33.98,27.89 R11.1
LED2  (via drill 0.35)
  Top 0.152: v43.43,28.8 45.26,28.8 U1.8 | v34.44,25.45 34.44,24.69 33.98,24.23 R12.1
  Bottom 0.152: v43.43,28.8 37.8,28.8 v34.44,25.45
LED3
  Top 0.152: U1.9 45.26,28.19 44.35,28.19 40.39,24.23 R13.1
LED4
  Top 0.152: U1.10 46.02,27.58 47.55,29.11 47.55,32.92 44.65,35.81 30.63,35.81 28.19,33.38 28.19,23.47 29.57,22.1 32.61,22.1 33.83,20.88 33.83,20.42 R14.1
LED5  (via drill 0.35)
  Top 0.152: v41.6,24.23 44.2,26.82 45.26,26.82 U1.11 | v35.05,17.68 33.98,16.61 R15.1
  Bottom 0.152: v35.05,17.68 v41.6,24.23
LED6
  Top 0.152: U1.12 45.41,26.36 46.02,26.36 47.85,28.19 47.85,33.07 39.01,41.91 26.67,41.91 24.38,39.62 23.77,39.62 23.16,40.23 23.16,43.59 31.55,51.97 38.41,51.97 R16.1
LED7  (via drill 0.35)
  Top 0.152: v47.55,26.98 46.33,25.76 45.41,25.76 U1.13 | v48.77,28.19 48.77,29.57 48.46,29.87 48.46,41.3 43.59,46.18 43.59,51.97 R17.1
  Bottom 0.152: v48.77,28.19 v47.55,26.98
MISO  (via drill 0.35)
  Top 0.152: v30.79,9.6 28.19,12.19 25.76,12.19 IC1.MISO | v97.69,20.73 97.69,71.32 91.75,77.27 90.07,77.27 89,76.2 SV1.37
  Bottom 0.152: v30.79,9.6 32.46,9.6 39.62,2.44 81.38,2.44 91.59,12.65 91.59,14.63 v97.69,20.73
MOSI  (via drill 0.35)
  Top 0.152: v26.06,34.75 26.06,33.22 23.32,30.48 23.32,20.57 25.6,18.29 IC1.MOSI | v50.9,53.03 v49.68,53.03 | v74.68,61.57 76.96,61.57 79.55,64.16 v85.95,64.16
  Bottom 0.152: v26.06,34.75 33.22,41.91 33.83,41.91 44.96,53.03 v49.68,53.03 | v50.9,53.03 51.97,53.03 60.66,61.72 73,61.72 73.15,61.87 74.37,61.87 v74.68,61.57 | v85.95,64.16 85.95,66.45 85.8,66.6 85.8,70.56 SV1.38
N$1
  Top 0.152: R1.1 LED_TX.A
N$2
  Top 0.152: R2.1 LED_RX.A
N$8
  Top 0.152: U1.23 54.56,30.18 56.08,31.7 R24.2
N$10
  Top 0.152: R23.2 67.51,60.96 67.51,59.44 62.18,54.1 61.87,54.1 U3.18
N$15
  Top 0.152: U1.1 45.26,33.38 41.91,33.38 40.39,31.85 R28.2
N$16
  Top 0.152: R25.2 66.6,57.15 62.18,52.73 61.87,52.73 U3.17
N$17  (via drill 0.35)
  Top 0.152: R40.1 78.49,67.36 82.75,67.36 R41.2 82.91,67.36 83.97,68.43 85.5,68.43 86.41,67.51 v86.41,66.9 | v95.86,40.69 95.86,10.52 88.39,3.05 12.5,3.05 8.99,6.55 8.99,8.99 9.45,9.45 10.97,9.45 12.19,8.23 12.19,7.92 IC1.ADC
  Bottom 0.152: v95.86,40.69 95.86,57.45 v86.41,66.9
N$18
  Top 0.152: R26.2 64.01,53.34 62.18,51.51 61.87,51.51 U3.16
N$19
  Top 0.152: R27.2 67.67,41.91 67.67,45.57 63.09,50.14 61.87,50.14 U3.15
N$20
  Top 0.152: U1.2 45.26,32.77 44.65,32.77 40.39,28.5 40.39,28.04 R29.2
N$21
  Top 0.152: U1.3 45.26,32 44.5,32 41.3,28.8 41.3,27.13 40.23,26.06 37.64,26.06 34.75,28.96 33.22,28.96 33.07,28.8 33.07,26.98 33.98,26.06 34.75,26.06 39.01,21.79 44.35,21.79 46.94,24.38 61.11,24.38 61.42,24.69 61.42,27.58 61.27,27.74 61.27,29.87 62.18,30.79 62.18,33.98 64.16,35.97 64.16,41 63.25,41.91 R30.2
N$22  (via drill 0.35)
  Top 0.152: v46.63,31.55 45.41,31.55 U1.4 | v49.38,32 49.38,32.31 49.07,32.61 49.07,35.36 55.63,41.91 R31.2
  Bottom 0.152: v46.63,31.55 48.92,31.55 v49.38,32
N$23  (via drill 0.35)
  Top 0.152: v44.04,30.18 44.65,30.79 45.26,30.79 U1.5 | v53.95,24.99 57.15,28.19 57.15,35.81 56.24,36.73 R32.2
  Bottom 0.152: v44.04,30.18 44.04,29.57 48.62,24.99 v53.95,24.99
N$24
  Top 0.152: U1.24 51.21,30.79 52.12,30.79 52.27,30.63 52.88,30.63 55.32,33.07 55.32,39.17 57.15,41 57.15,42.82 57.3,42.98 62.03,42.98 62.18,42.82 62.18,37.8 63.09,36.88 R33.2
N$25
  Top 0.152: T1.B 43.43,16.61 42.37,16.61 38.56,12.8 R34.1
N$26
  Top 0.152: T2.B 48.46,16.61 48.46,15.85 45.41,12.8 R35.1
N$27  (via drill 0.35)
  Top 0.152: v28.8,23.77 28.8,33.53 30.79,35.51 31.39,35.51 32,34.9 32,31.85 R10.2 | v8.08,30.33 8.08,37.64 LED0.K
  Bottom 0.152: v28.8,23.77 22.4,23.77 15.85,30.33 v8.08,30.33
N$28  (via drill 0.35)
  Top 0.152: v31.7,29.26 32,28.96 32,28.04 R11.2 | v16.61,32.31 15.54,32.31 13.56,34.29 13.56,38.41 11.43,40.54 LED1.K
  Bottom 0.152: v31.7,29.26 19.66,29.26 v16.61,32.31
N$29  (via drill 0.35)
  Top 0.152: v29.41,29.87 29.41,28.35 32,25.76 32,24.23 R12.2 | v20.12,32.77 18.9,33.98 18.9,39.47 17.83,40.54 LED2.K
  Bottom 0.152: v29.41,29.87 23.01,29.87 v20.12,32.77
N$30
  Top 0.152: R13.2 38.56,24.08 40.54,22.1 43.74,22.1 48.16,26.52 48.16,33.22 39.17,42.22 25.76,42.22 24.23,40.69 LED3.K
N$31
  Top 0.152: R14.2 32,20.27 27.43,20.27 26.52,19.36 24.99,19.36 24.69,19.66 24.69,21.18 26.67,23.16 26.67,36.73 30.48,40.54 LED4.K
N$32  (via drill 0.35)
  Top 0.152: v31.09,34.9 31.09,27.13 33.07,25.15 33.07,23.16 34.9,21.34 34.9,19.36 32.16,16.61 R15.2
  Bottom 0.152: LED5.K v31.09,34.9
N$33
  Top 0.152: LED6.K 40.39,43.43 40.39,51.97 R16.2
N$34
  Top 0.152: R17.2 45.41,51.97 45.41,44.81 49.53,40.69 LED7.K
N$35  (via drill 0.35)
  Top 0.152: v13.72,16.92 5.03,25.6 5.03,30.94 4.27,31.7 4.27,32.92 R39.1 | R37.1 33.98,8.84 41,8.84 41.15,8.69 RESET.1
  Bottom 0.152: v13.72,16.92 32,16.92 40.23,8.69 41.15,8.69 RESET.1
N$36
  Top 0.152: R36.1 48.62,12.65 48.62,11.43 51.36,8.69 FLASH.1
N$37
  Top 0.152: R38.1 LED_BLUE.A
OMA1
  Top 0.152: MOTOR.1 83.06,57.15 76.81,50.9 76.2,50.9 IC3.3
OMA2
  Bottom 0.152: IC3.6 76.2,43.28 81.99,43.28 83.52,44.81 84.89,44.81 92.2,52.12 92.2,52.88 93.88,54.56 MOTOR.2
OMB1
  Top 0.152: MOTOR.3 92.81,50.9 83.82,50.9 IC3.14
OMB2
  Top 0.152: IC3.11 83.82,43.28 87.63,43.28 93.88,49.53 MOTOR.4
PWM10  (via drill 0.35)
  Top 0.152: v55.17,27.58 53.95,26.36 51.21,26.36 U1.17 | v67.97,28.65 v62.64,28.65 | v73.76,28.65 88.39,28.65 88.85,29.11 SERVO1.3 | v64.77,76.05 63.55,74.83 63.55,73.76 SV1.18
  Bottom 0.152: v55.17,27.58 60.5,27.58 61.57,28.65 v62.64,28.65 | v73.76,28.65 v67.97,28.65 | v64.77,76.05 64.77,76.35 66.9,78.49 90.53,78.49 96.77,72.24 96.77,35.66 92.2,31.09 90.83,31.09 89,29.26 SERVO1.3
PWM11  (via drill 0.35)
  Top 0.152: v53.49,26.98 51.21,26.98 U1.18 | v68.73,28.04 v61.87,28.04 | v72.24,28.04 74.22,30.02 83.36,30.02 SERVO2.3 90.68,37.34 91.59,37.34 96.77,42.52 96.77,62.48 87.94,71.32 87.94,76.5 v86.56,77.88
  Bottom 0.152: v53.49,26.98 60.81,26.98 v61.87,28.04 | v72.24,28.04 v68.73,28.04 | SV1.19 67.21,76.2 68.89,77.88 v86.56,77.88
PWM12  (via drill 0.35)
  Top 0.152: v54.25,27.58 U1.19 | v77.27,35.36 83.06,35.36 88.85,41.15 88.85,41.91 SERVO3.3 | v60.2,59.89 60.2,65.38 60.81,65.99 62.64,65.99 65.99,69.34 65.99,73.61 SV1.20
  Bottom 0.152: v54.25,27.58 56.08,29.41 63.86,29.41 65.08,30.63 65.84,30.63 | 65.84,30.63 72.54,30.63 v77.27,35.36 | v60.2,59.89 60.2,57.15 54.71,51.66 54.71,44.65 65.84,33.53 65.84,30.63
PWM13
  Top 0.152: SV1.21 69.65,75.13 69.65,72.39 76.66,65.38 89.76,65.38 95.86,59.28 95.86,49.23 95.1,48.46 93.27,48.46 87.78,42.98 87.78,42.67 84.12,39.01 68.73,39.01 63.86,43.89 55.47,43.89 54.41,42.82 54.41,42.37 48.77,36.73 48.77,30.02 50.44,28.35 51.05,28.35 U1.20
PWM14  (via drill 0.35)
  Top 0.152: v52.58,29.57 51.97,28.96 51.21,28.96 U1.21 | v52.58,31.24 53.49,32.16 v53.49,38.86 | v58.06,57.76 58.06,64.62 58.67,65.23 v58.67,65.53
  Bottom 0.152: v52.58,31.24 v52.58,29.57 | v53.49,38.86 53.49,53.19 v58.06,57.76 | v58.67,65.53 64.92,71.78 66.9,71.78 68.58,73.46 SV1.22
PWM15  (via drill 0.35)
  Top 0.152: v49.84,30.18 50.44,29.57 51.05,29.57 U1.22 | v51.36,45.41 51.36,45.87 58.67,53.19 58.67,64.62 v59.59,65.53
  Bottom 0.152: v49.84,30.18 49.84,31.55 51.36,33.07 v51.36,45.41 | v59.59,65.53 66.9,65.53 74.68,73.3 74.68,74.07 73.61,75.13 72.24,75.13 71.17,76.2 SV1.23
RTS  (via drill 0.35)
  Top 0.152: R35.2 43.59,12.8 45.26,14.48 45.26,16.61 T1.E 45.26,16.76 v45.26,21.34 | SV5.5 34.29,57.45 33.68,56.84 32.92,56.84 IC2.3 32.77,56.69 v31.55,56.69 | v25.45,33.53 25.45,37.03 22.55,39.93 v22.55,47.7
  Bottom 0.152: v45.26,21.34 45.26,27.89 39.62,33.53 v25.45,33.53 | v31.55,56.69 v22.55,47.7
RXD
  Top 0.152: 33.83,70.87 33.83,74.22 31.85,76.2 SV5.4 | 33.83,70.87 33.83,58.37 33.68,58.22 32.92,58.22 IC2.5 | 33.83,70.87 13.72,70.87 2.9,60.05 2.9,41.45 7.01,37.34 7.01,29.57 10.21,26.36 10.21,22.86 IC1.TXD/IO1
  Bottom 0.152: SV1.26 73.61,73.76 72.39,73.76 71.02,75.13 60.66,75.13 59.44,76.35 59.44,76.66 57.61,78.49 34.14,78.49 31.85,76.2 SV5.4
RXLED
  Top 0.152: LED_RX.C 4.57,53.34 6.71,55.47 21.03,55.47 24.84,59.28 25.45,59.28 IC2.22
SCL  (via drill 0.35)
  Top 0.152: v12.65,31.55 12.8,31.39 12.8,29.72 14.17,28.35 14.17,22.86 IC1.IO5 | v52.58,32.16 51.21,32.16 U1.26 | v65.23,31.24 67.06,31.24 67.51,31.7 R3.1 | v54.1,52.58 52.58,52.58 U3.12 52.43,52.73 52.12,52.73 v50.44,54.41 | SV1.3 45.72,75.13 46.79,74.07 v46.79,68.12
  Bottom 0.152: v12.65,31.55 14.17,31.55 16.61,33.98 16.61,34.75 17.37,35.51 19.05,35.51 20.27,34.29 U$1.SCL 21.18,34.29 29.11,42.22 33.68,42.22 45.87,54.41 v50.44,54.41 50.44,61.72 46.79,65.38 v46.79,68.12 | 53.03,32.16 v52.58,32.16 | 53.03,32.16 55.47,29.72 63.7,29.72 v65.23,31.24 | v54.1,52.58 54.1,33.22 53.03,32.16
SCLK  (via drill 0.35)
  Top 0.152: v27.28,34.9 27.28,23.32 25.76,21.79 25.76,20.42 IC1.SCLK | v51.05,52.12 v49.68,52.12 | v73.46,61.27 76.96,64.77 v89.46,64.77
  Bottom 0.152: v27.28,34.9 44.5,52.12 v49.68,52.12 | v51.05,52.12 51.51,52.12 60.66,61.27 v73.46,61.27 | v89.46,64.77 89.46,71.63 91.44,73.61 SV1.40
SDA  (via drill 0.35)
  Top 0.152: v49.68,32.92 51.05,32.92 U1.27 | U$1.SDA 22.86,32.16 16.31,25.6 16.31,22.86 IC1.IO4 | v64.77,39.62 67.51,36.88 R4.1 | v55.32,51.21 52.73,51.21 52.58,51.36 U3.13 52.43,51.51 49.38,51.51 | v38.86,71.93 38.86,58.06 37.49,56.69 37.49,55.02 39.32,53.19 47.7,53.19 49.38,51.51 | v48.31,42.98 48.31,50.44 49.38,51.51
  Bottom 0.152: 48.31,32.92 40.69,32.92 39.47,34.14 23.01,34.14 U$1.SDA | 48.31,32.92 v49.68,32.92 | v64.77,39.62 64.77,40.23 55.32,49.68 v55.32,51.21 | v38.86,71.93 43.13,76.2 SV1.1 | v48.31,42.98 48.31,32.92
TXD  (via drill 0.35)
  Top 0.152: v35.36,59.28 35.36,77.42 34.75,78.03 31.09,78.03 29.26,76.2 SV5.3 | IC2.1 32.77,55.47 v31.55,55.47 27.74,51.66 24.99,51.66 v16,42.67 | v10.52,31.55 12.19,29.87 12.19,22.86 IC1.RXD/IO3
  Bottom 0.152: v35.36,59.28 v31.55,55.47 | v10.52,31.55 10.52,37.19 v16,42.67 | SV1.24 71.02,73.76 69.95,73.76 68.89,74.83 58.37,74.83 56.84,76.35 56.84,76.66 55.32,78.18 36.58,78.18 35.36,76.96 35.36,74.98 34.75,74.37 31.09,74.37 29.26,76.2 SV5.3
TXLED
  Top 0.152: LED_TX.C 4.57,49.53 7.32,52.27 13.72,52.27 14.02,52.58 14.02,54.25 14.94,55.17 21.34,55.17 24.84,58.67 25.45,58.67 IC2.23
USBDM
  Top 0.152: IC2.16 25.45,63.4 20.12,63.4 14.94,68.58 X1.2
USBDP
  Top 0.152: IC2.15 25.45,64.01 20.88,64.01 15.24,69.65 14.02,69.65 12.95,68.58 X1.3
VCC_MOTOR
  Top 0.152: SV1.8 50.75,73.76 50.75,76.2 SV1.7
  Bottom 0.152: IC3.8 67.36,38.1 62.64,42.82 62.64,45.87 76.96,60.2 | C4.+ 76.96,60.2 | 76.96,60.2 74.22,62.94 55.02,62.94 50.75,67.21 50.75,73.61 SV1.8

### Text on the board
tNames: CoderDojo | S | 5V | G | Sam Decoster | V1.0